# EasyEDA Pro project DCP_main.eprj, board PCB3
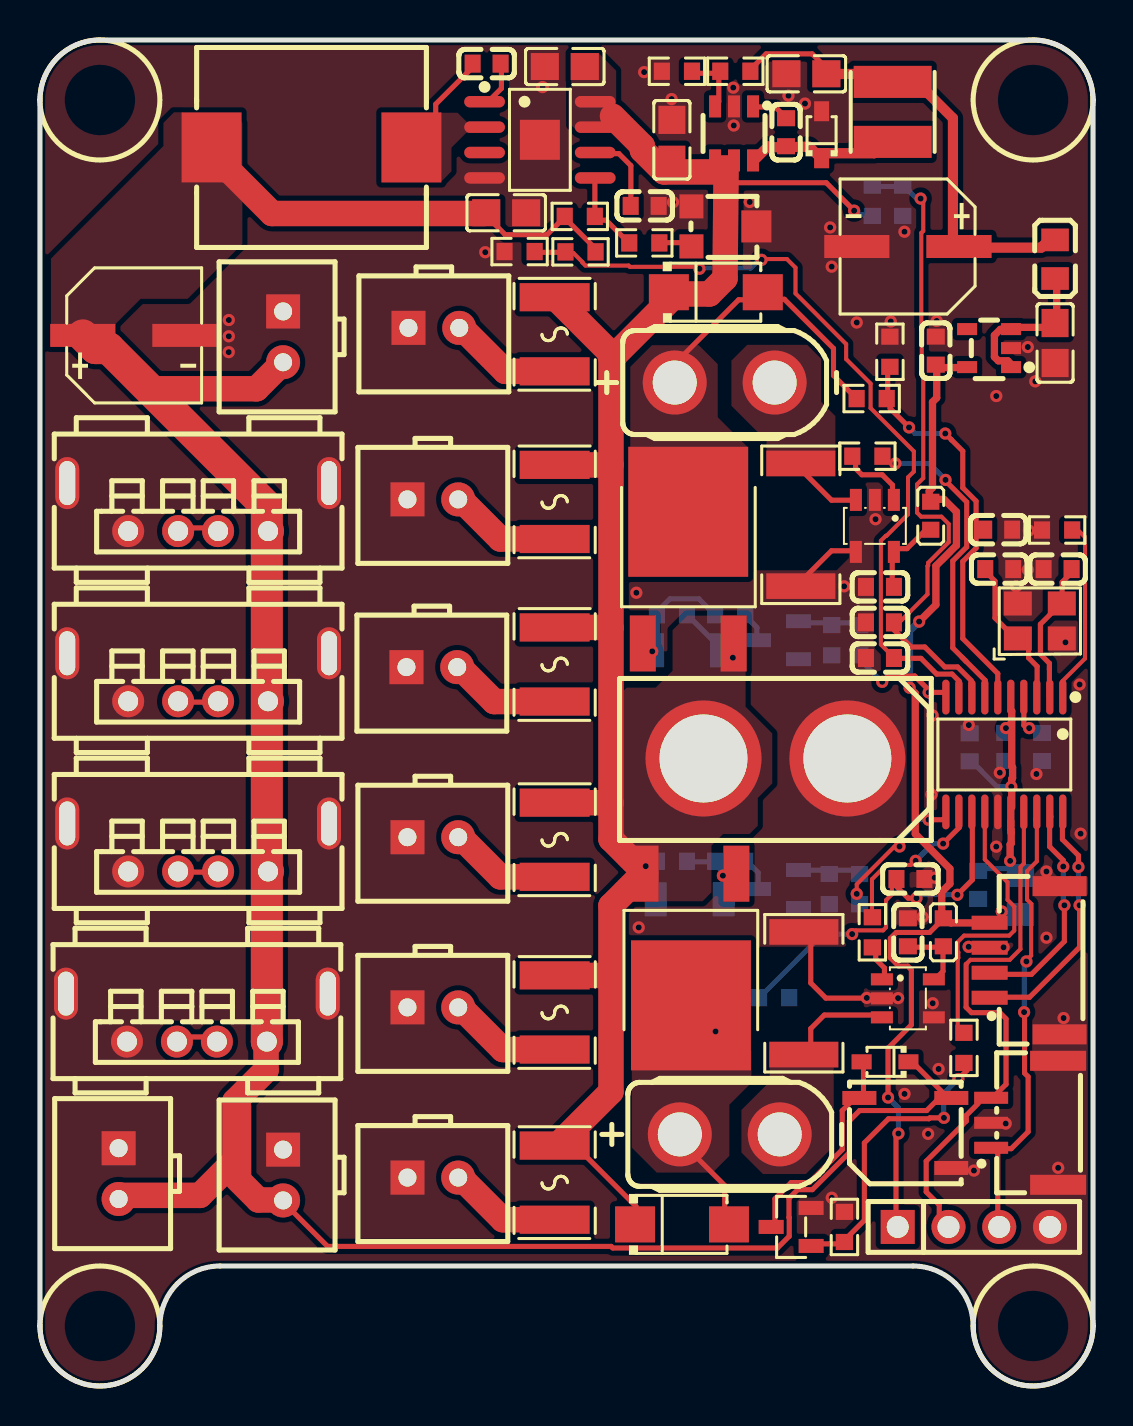
[diagram p4: board, top side]
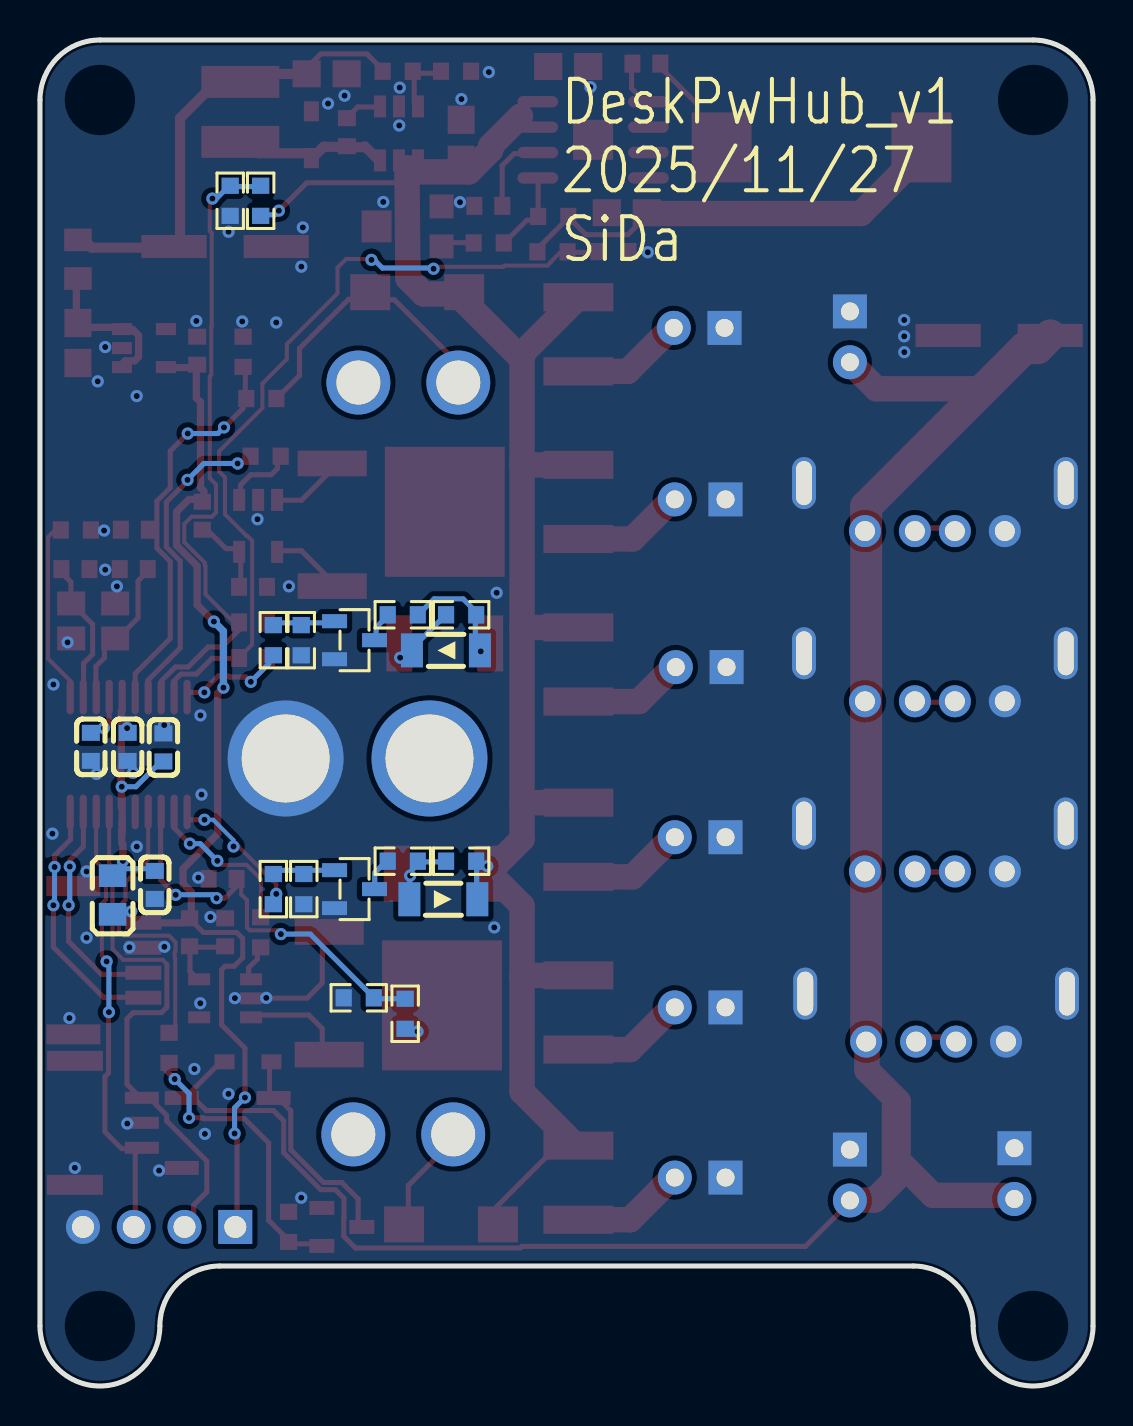
[diagram p5: board, bottom side, seen from below]

Outline 52.7 x 67.3 mm; copper layers: Top Layer, Bottom Layer. Coordinates in mm from the lower left corner of the outline.
Outline path: 0,64.3 arc(0.88,66.42) 3,67.3 49.7,67.3 arc(51.82,66.42) 52.7,64.3 52.7,3 arc(49.7,0) 46.7,3 arc(45.82,5.12) 43.7,6 9,6 arc(6.88,5.12) 6,3 arc(3,0) 0,3 0,64.3
Stack: Top Layer 0.035mm / Dielectric1 1.51mm FR4 er 4.5 / Bottom Layer 0.035mm

## Design rules (mm)
template: 自定义配置
spacing copperThickness1oz (default): track to track 0.102, other pairs 0.152 to 0.3
spacing copperThickness2oz: track to track 0.203, other pairs 0.152 to 0.3
track width copperThickness1oz (default): min 0.127, default 0.254, max 2.54
track width copperThickness2oz: min 0.203, default 0.254, max 2.54
differential pair differentialPair (default): width min 0.127, default 0.254, max 2.54; gap min 0.152, default 0.152
via viaSize (default): diameter min 0.5, default 0.61, max 10; hole min 0.3, default 0.305, max 6.3

## Placement (name value [footprint] x y rotation side)
BLE1  -  [HDR-TH_4P-P2.54-V-F]  46.74 7.95 0 top
BUZZER5  4kHz  [BUZ-SMD_L5.0-W5.5-P4.60]  43.31 12.65 180 top
C3  100nF  [C0603]  22.35 66.12 0 top
C4  10uF  [C0805]  26.26 65.97 0 top
C5  1uF  [C0603]  30.26 59.01 180 top
C6  10uF  [C0805]  23.33 58.66 180 top
C7  100uF  [CAP-SMD_BD6.3-L6.6-W6.6-RD]  4.7 52.53 180 top
C8  10uF  [C0805]  38.35 65.61 0 top
C9  100uF  [CAP-SMD_BD6.3-L6.6-W6.6-RD]  43.43 56.97 0 top
C10  10uF  [C0805]  31.62 62.31 270 top
C11  100nF  [C0603]  37.34 62.69 270 top
C12  10uF  [C0805]  50.8 52.15 90 top
C13  2.2uF  [C0603]  44.83 51.77 270 top
C14  100nF  [C0603]  50.15 31.96 90 bottom
C15  20pF  [C0603]  48.01 40.85 180 top
C16  20pF  [C0603]  50.93 40.85 0 top
C17  100nF  [C0603]  48.31 31.96 270 bottom
C19  4.7uF  [C0603]  46.96 25.06 270 bottom
C20  100nF  [C0603]  46.52 31.93 270 bottom
C21  10uF  [C0603]  42.04 39.96 0 top
C22  10uF  [C0603]  43.43 22.69 270 top
C23  1nF  [C0603]  47.95 42.82 180 top
C24  1nF  [C0603]  43.56 25.35 180 top
C25  1nF  [C0603]  42.04 36.4 0 top
C26  1nF  [C0603]  42.04 38.18 0 top
CN1  XT30UPB-F30.G.Y  [CONN-TH_XT30UPB-F]  34.27 50.17 0 top
CN4  WAFER-GH1.25-3PLB  [CONN-SMD_3P-P1.25_XUNPU_WAFER-GH1.25-3PLB]  49.28 13.16 90 top
CN5  SWD  [CONN-SMD_4P-P1.27_GH125-S04DCA-00]  49.28 21.29 90 top
CN6  XT30UPB-F30.G.Y  [CONN-TH_XT30UPB-F]  34.52 12.58 0 top
CN7  XT60-M.  [CONN-TH_XT60]  36.81 31.38 180 top
D1  P4SMA18A  [SMA_L4.3-W2.7-LS5.0-RD]  33.82 54.69 0 top
D2  ZMM18  [LL-34_L3.5-W1.5-RD]  32.38 36.78 180 bottom
D3  P4SMA18A  [SMA_L4.3-W2.7-LS5.0-RD]  32.13 8.08 0 top
D4  ZMM18  [LL-34_L3.5-W1.5-RD]  32.51 24.34 0 bottom
D9  1N5819WS  [SOD-323_L1.8-W1.3-LS2.5-RD]  39.12 62.56 90 top
D10  1N4148WS  [SOD-323_L1.8-W1.3-LS2.5-RD]  42.29 16.21 180 top
F1  SMD1812-110-33  [F1812]  25.76 10.17 90 top
F2  SMD1812-110-33  [F1812]  25.76 27.31 90 top
F3  SMD1812-110-33  [F1812]  25.76 18.68 90 top
F4  SMD1812-110-33  [F1812]  25.76 36.08 90 top
F5  SMD1812-110-33  [F1812]  25.76 44.2 90 top
F6  SMD1812-110-33  [F1812]  25.76 52.59 90 top
H5  XY-XHB2.54-2A11  [CONN-TH_2P-P2.50_XY-XHB2.54-2A11]  12.17 10.55 270 top
H8  XY-XHB2.54-2A11  [CONN-TH_2P-P2.50_XY-XHB2.54-2A11]  19.66 10.42 0 top
H9  XY-XHB2.54-2A11  [CONN-TH_2P-P2.50_XY-XHB2.54-2A11]  19.66 27.44 0 top
H10  XY-XHB2.54-2A11  [CONN-TH_2P-P2.50_XY-XHB2.54-2A11]  19.66 18.93 0 top
H11  XY-XHB2.54-2A11  [CONN-TH_2P-P2.50_XY-XHB2.54-2A11]  19.61 35.94 0 top
H12  XY-XHB2.54-2A11  [CONN-TH_2P-P2.50_XY-XHB2.54-2A11]  19.66 44.33 0 top
H13  XY-XHB2.54-2A11  [CONN-TH_2P-P2.50_XY-XHB2.54-2A11]  19.71 52.91 0 top
H15  XY-XHB2.54-2A11  [CONN-TH_2P-P2.50_XY-XHB2.54-2A11]  3.94 10.62 270 top
H16  XY-XHB2.54-2A11  [CONN-TH_2P-P2.50_XY-XHB2.54-2A11]  12.17 52.46 270 top
L1  6.8uH  [IND-SMD_L11.5-W10.0_FXL1040]  13.59 61.93 0 top
L3  1.5K  [L0805]  50.8 56.34 270 top
L4  2.5K  [L0603]  44.58 43.51 270 top
L5  2.5K  [L0603]  45.21 22.69 270 top
L6  1.5K  [L0805]  49.06 24.55 90 bottom
L7  47uH  [IND-SMD_L4.0-W4.0_FNR40XXS]  42.67 63.71 90 top
Q1  NCE40P70K  [TO-252-2_L6.6-W6.1-P4.57-LS9.9-TL-CW]  32.44 40.42 90 top
Q2  MMS8050-H-TP  [SOT-23-3_L2.9-W1.3-P1.90-LS2.4-BR]  36.96 37.29 0 bottom
Q3  NCE40P70K  [TO-252-2_L6.6-W6.1-P4.57-LS9.9-TL-CW]  32.58 22.32 270 top
Q4  MMS8050-H-TP  [SOT-23-3_L2.9-W1.3-P1.90-LS2.4-BR]  36.96 24.84 0 bottom
Q10  SS8050  [SOT-23-3_L2.9-W1.3-P1.90-LS2.4-BR]  37.59 7.95 0 top
R1  1M  [R0603]  31.62 38.56 0 bottom
R2  10K  [R0603]  34.54 38.56 0 bottom
R3  10K  [R0603]  41.02 37.29 90 bottom
R4  100K  [R0603]  39.62 37.29 90 bottom
R5  1M  [R0603]  31.62 26.24 180 bottom
R6  10K  [R0603]  34.54 26.24 0 bottom
R7  10K  [R0603]  41.02 24.84 90 bottom
R8  100K  [R0603]  39.5 24.84 90 bottom
R17  100K  [R0603]  27.01 58.48 0 top
R18  13K  [R0603]  30.24 57.16 0 top
R19  1kΩ  [RES-ADJ-SMD_JER33X-1-14]  34.23 57.98 270 top
R21  110K  [R0603]  34.8 65.74 180 top
R22  15K  [R0603]  31.88 65.74 180 top
R23  10K  [R0603]  50.9 42.8 180 top
R26  10K  [R0603]  46.24 16.91 270 top
R27  100K  [R0603]  40.26 7.95 270 top
R28  6mΩ  [R2512]  38.08 43.06 90 top
R29  10  [R0603]  41.41 46.49 0 top
R30  6mΩ  [R2512]  38.23 19.64 270 top
R31  10  [R0603]  41.66 22.69 90 top
R32  11K  [R0603]  41.62 49.37 180 top
R33  1.5K  [R0603]  42.53 51.71 270 top
R34  11K  [R0603]  34.43 18.61 270 bottom
R35  1.5K  [R0603]  36.75 19.41 180 bottom
R36  5.6K  [R0603]  27.05 56.71 0 top
R37  6.8K  [R0603]  24 56.72 0 top
R38  11K  [R0603]  41.66 59.26 270 bottom
R39  1.5K  [R0603]  43.18 59.26 90 bottom
U1  SY8205FCC  [SOIC-8_L5.0-W4.0-P1.27-LS6.0-BL-EP2.0]  25.02 62.31 270 top
U2  SY8401ABC  [SOT-23-6_L2.9-W1.6-P0.95-LS2.8-BR]  34.73 62.63 90 top
U3  TPS7A2033PDBVR  [SOT-23-5_L2.9-W1.6-P0.95-LS2.8-BR]  47.5 51.89 0 top
U4  GD32E230F4P6TR  [TSSOP-20_L6.5-W4.4-P0.65-LS6.4-BL]  48.26 31.58 180 top
U5  INA180A1IDBVR  [SOT-23-5_L3.0-W1.7-P0.95-LS2.8-BR]  41.78 43 90 top
U6  INA180A1IDBVR  [SOT-23-5_L3.0-W1.7-P0.95-LS2.8-BR]  43.43 19.38 180 top
USB2  AF 180°ZJB13.7  [USB-A-TH_AF-ZJB13.7]  7.91 26.93 180 top
USB3  AF 180°ZJB13.7  [USB-A-TH_AF-ZJB13.7]  7.85 18.42 180 top
USB4  AF 180°ZJB13.7  [USB-A-TH_AF-ZJB13.7]  7.91 35.44 180 top
USB5  AF 180°ZJB13.7  [USB-A-TH_AF-ZJB13.7]  7.91 43.95 180 top
X1  8MHz  [OSC-SMD_4P-L3.2-W2.5-BL]  50.04 38.25 0 top

## Footprints (pads in the part's own frame, mm; a bottom-side part is the same pattern mirrored in y, then rotated)
BUZ-SMD_L5.0-W5.5-P4.60
  rect 1.7x0.7 smd: 1(-2.3,-1.75) 2(2.3,-1.75) 3(-2.3,1.75)
C0603
  rect 0.8x0.9 smd: 1(-0.7,0) 2(0.7,0)
C0805
  rect 1.41x1.35 smd: 1(-1,0) 2(1,0)
CAP-SMD_BD6.3-L6.6-W6.6-RD
  rect 3.26x1.15 smd: 1(2.555,0) 2(-2.555,0)
CONN-SMD_3P-P1.25_XUNPU_WAFER-GH1.25-3PLB
  rect 0.6x1.7 smd: 1(-1.25,1.675) 2(0.001,1.675) 3(1.25,1.675)
  rect 1x2.8 smd: 4(3.1,-1.675) 5(-3.1,-1.675)
CONN-SMD_4P-P1.27_GH125-S04DCA-00
  rect 0.7x1.8 smd: 1(-1.875,1.75) 2(-0.625,1.75) 3(0.625,1.75) 4(1.875,1.75)
  rect 1x2.7 smd: 5(3.705,-1.75) 6(-3.705,-1.75)
CONN-TH_2P-P2.50_XY-XHB2.54-2A11
  rect 1.7x1.7 hole 0.9: 1(-1.27,0)
  round 1.7 hole 0.9: 2(1.27,0)
CONN-TH_XT30UPB-F
  round 3.2 hole 2.2: 1(-2.5,0) 2(2.5,0)
CONN-TH_XT60
  round 5.8 hole 4.4: 1(-3.6,0) 2(3.6,0)
F1812
  rect 1.407x3.499 smd: 1(-1.853,0) 2(1.853,0)
HDR-TH_4P-P2.54-V-F
  rect 1.7x1.7 hole 1.1: 1(-3.81,0)
  round 1.7 hole 1.1: 2(-1.27,0) 3(1.27,0) 4(3.81,0)
IND-SMD_L4.0-W4.0_FNR40XXS
  rect 1.6x3.9 smd: 1(-1.5,0) 2(1.5,0)
IND-SMD_L11.5-W10.0_FXL1040
  rect 3x3.5 smd: 1(-5,0) 2(5,0)
L0603
  rect 0.8x0.864 smd: 1(-0.7,0) 2(0.7,0)
L0805
  rect 1.133x1.377 smd: 1(-0.966,0) 2(0.966,0)
LL-34_L3.5-W1.5-RD
  rect 1.1x1.7 smd: 1(-1.7,0) 2(1.7,0)
OSC-SMD_4P-L3.2-W2.5-BL
  rect 1.4x1.2 smd: 1(-1.1,-0.875) 2(1.1,-0.875) 3(1.1,0.875) 4(-1.1,0.875)
R0603
  rect 0.806x0.864 smd: 1(-0.753,0) 2(0.753,0)
R2512
  rect 1.282x3.456 smd: 1(-3.067,0) 2(3.067,0)
RES-ADJ-SMD_JER33X-1-14
  rect 1.2x1.2 smd: 1(1,-1.625) 3(-1,-1.625)
  rect 1.6x1.5 smd: 2(0,1.625)
SMA_L4.3-W2.7-LS5.0-RD
  rect 2x1.8 smd: 1(-2.35,0) 2(2.35,0)
SOD-323_L1.8-W1.3-LS2.5-RD
  rect 1x0.75 smd: 1(-1.173,0) 2(1.173,0)
SOIC-8_L5.0-W4.0-P1.27-LS6.0-BL-EP2.0
  oval 0.574x2.038 smd: 1(-1.905,-2.769) 2(-0.635,-2.769) 3(0.635,-2.769) 4(1.905,-2.769) 5(1.905,2.769) 6(0.635,2.769) 7(-0.635,2.769) 8(-1.905,2.769)
  rect 2x2 smd: 9(0,0)
SOT-23-3_L2.9-W1.3-P1.90-LS2.4-BR
  rect 1.25x0.7 smd: 1(1,-0.95) 2(1,0.95) 3(-1,0)
SOT-23-5_L2.9-W1.6-P0.95-LS2.8-BR
  rect 1x0.6 smd: 1(1.1,-0.95) 2(1.1,0) 3(1.1,0.95) 4(-1.1,0.95) 5(-1.1,-0.95)
SOT-23-5_L3.0-W1.7-P0.95-LS2.8-BR
  rect 1.1x0.6 smd: 1(1.3,-0.95) 2(1.3,0) 3(1.3,0.95) 4(-1.3,0.95) 5(-1.3,-0.95)
SOT-23-6_L2.9-W1.6-P0.95-LS2.8-BR
  rect 1.1x0.6 smd: 1(1.35,-0.95) 2(1.35,0) 3(1.35,0.95) 4(-1.35,0.95) 5(-1.35,0) 6(-1.35,-0.95)
TO-252-2_L6.6-W6.1-P4.57-LS9.9-TL-CW
  rect 2.8x1.3 smd: 1(-3.292,2.273) 3(-3.292,-2.273)
  rect 6.5x6 smd: 2(3.292,0)
TSSOP-20_L6.5-W4.4-P0.65-LS6.4-BL
  oval 0.364x1.742 smd: 1(-2.925,-2.871) 2(-2.275,-2.871) 3(-1.625,-2.871) 4(-0.975,-2.871) 5(-0.325,-2.871) 6(0.325,-2.871) 7(0.975,-2.871) 8(1.625,-2.871) 9(2.275,-2.871) 10(2.925,-2.871) 11(2.925,2.871) 12(2.275,2.871) 13(1.625,2.871) 14(0.975,2.871) 15(0.325,2.871) 16(-0.325,2.871) 17(-0.975,2.871) 18(-1.625,2.871) 19(-2.275,2.871) 20(-2.925,2.871)
USB-A-TH_AF-ZJB13.7
  round 1.6 hole 1: 1(-3.5,1.2) 2(-1,1.2) 3(1,1.2) 4(3.5,1.2)
  oval 1.2x2.6 hole 0.8x2.2: 5(-6.55,-1.2) 5(6.55,-1.2)

## Nets
As in the schematic.

Pads without a net: U1 3; U3 4

## Via types
v1: diameter 0.61, hole 0.305, Top Layer to Bottom Layer, 95 vias

## Routing (per net, layer and track width the routed paths; a pad name or vN(x,y) marks a point on that pad's centre or on a via; arc(x,y) is an arc through that point)
12V_CTL1: length 6.4
  Top Layer w0.203: v1(40.88,24.61) 40.88,25.09 42.76,26.98 v1(43.02,26.98)
  Top Layer w0.254: 45.24,28.36 45.19,28.31 v1(44.47,28.31)
  Bottom Layer w0.203: v1(43.02,26.98) 43.02,27.29 44.03,28.31 v1(44.47,28.31)
12V_CTL2: length 5.3
  Top Layer w0.254: 44.49,34.78 43.78,35.5 43.28,35.5 43.23,35.45 42.39,35.45 v1(42.15,35.21) ; 45.34,34.55 45.21,34.68 v1(44.47,34.68)
  Bottom Layer w0.254: v1(42.15,35.21) 41.25,36.11 41.25,36.47
+3.3V: length 52.8
  Top Layer w0.254: 45.08,23.23 44.52,22.68 42.85,22.68 42.56,22.38 ; 42.55,22.38 42.55,21.42 42.98,20.99 43.43,20.99 43.61,20.81 43.61,18.06 42.44,16.89 v1(42.44,14.42) ; v1(42.96,12.62) 42.84,12.5 42.84,8.05
  Top Layer w0.363: 46.34,50.92 45.13,50.92 ; 44.75,44.33 45.24,44.33 45.86,43.71 45.86,42.03 44.83,41 44.83,39.06 v1(44,38.22) ; 44.5,44.22 44.5,44.75 44.67,44.91 44.67,49.2 44.88,49.41 44.88,50.97 ; v1(43.52,34.92) 43.8,34.63 43.8,27.61 45.54,25.86 45.54,25.11 45.13,24.7 45.13,23.48 ; 45.33,23.42 45.6,23.16 47.64,23.16
  Bottom Layer w0.254: v1(42.44,14.42) 42.96,13.9 v1(42.96,12.62)
  Bottom Layer w0.363: v1(43.52,34.92) 43.52,37.74 v1(44,38.22)
  vias: v1(48.13,23.73)
+3.3V_MCU: length 11.3
  Top Layer w0.254: 48.33,32.95 48.59,33.21
  Top Layer w0.363: v1(48.55,26.26) 48.55,27.08 48.61,27.13 48.61,27.66 48.6,27.67 48.6,27.82 48.59,27.83 48.59,28.23 ; 48.63,28.94 48.63,30.36 48.67,30.4 48.67,30.93 48.63,30.97 48.63,33.74 48.59,33.77
  Bottom Layer w0.254: 46.59,31.27 47.9,29.96 v1(48.61,29.96) ; 48.54,25.89 48.52,25.87 47.09,25.87
  vias: v1(48.34,32.89)
+5V_1: length 128
  Top Layer w0.254: 43.71,16.15 45.35,14.5 ; 12.23,9.14 14.39,6.98 28.59,6.98 28.67,6.9 36.91,6.9 37.5,7.49 37.5,8.42 37.48,8.43 37.48,9.38 37.92,9.82 38.65,9.82 40.5,11.67 40.5,13.26 41.02,13.77 44.37,13.77 45.02,14.41 45.15,14.41 45.16,14.4 ; 45.35,14.32 45.41,14.32 ; 22.69,58.16 23.28,57.57 25.38,57.57 26.18,58.37 ; 27.85,56.82 26.38,58.29 26.38,58.33
  Top Layer w1.27: 9.94,13.97 9.94,10.37 9.92,10.35 ; 12.15,9.3 10.93,9.3 9.9,10.33 ; 3.96,9.53 8.01,9.53 9.75,11.28 9.75,14.24 11.31,15.79 11.31,16.95 ; 8.59,61.65 11.61,58.62 22.24,58.62 ; H16.2 10.84,49.86 5.84,49.86
  Top Layer w1.6: USB3.1 11.35,43.97 3.43,51.89 2.78,51.89 C7.1
+5V_1_ADC: length 40.7
  Top Layer w0.203: 26.3,56.65 26.7,56.65 27.15,56.2 27.15,56.17 27.3,56.02 29.46,56.02 29.52,55.96 32.81,55.96 32.87,55.9 ; 36.27,56.35 37.38,56.35 37.81,55.92 37.81,54.63 40.34,52.09 40.34,51.34 41.57,50.12 41.57,48.9 43.73,46.73 43.73,45.73 43.44,45.43 43.44,43.59 42.36,42.51 42.33,42.51 42.08,42.26 42.08,37.07 42.77,36.39
  Top Layer w0.254: 24.75,56.68 26.09,56.68 ; 42.66,36.38 44.09,36.38 44.87,35.6 45.65,35.6 46,35.24 46,34.47
  Bottom Layer w0.254: 33,55.9 35.56,55.9 36.02,56.36
  vias: v1(33,55.86) v1(36.11,56.31)
+5V_2: length 20.4
  Top Layer w0.254: 39.48,65.77 38.65,66.61 36.34,66.61 35.51,65.78
  Top Layer w0.508: 39.75,65.6 41.81,65.6 42.23,65.19 ; 50.57,57.38 50.1,56.92 46.33,56.92 ; 45.69,57.03 45.69,63.39 44.06,65.01
+12V: length 94.9
  Top Layer w0.254: 29.83,8.02 29.83,8.98 26.87,11.94 ; 34.61,60.16 39.35,60.16 v1(40.74,58.77)
  Top Layer w0.508: 34.7,61.3 34.68,61.28 33.78,61.28
  Top Layer w1.27: F3.2 28.52,20.53 28.57,20.48 ; 28.57,51.52 28.57,46.06 ; 28.57,51.52 28.57,51.62 25.76,54.44 ; 28.57,51.52 28.53,51.48 ; 28.57,51.52 28.76,51.52 31.84,54.6 33.51,54.6 34.28,55.38 34.34,60.75 ; 28.57,46.06 F5.2 ; 28.57,46.06 28.57,37.92 ; 34.27,60.7 31.24,60.7 30.15,61.79 30.15,62 28.65,63.49 ; F2.2 28.56,29.17 28.57,29.15 ; 28.57,37.92 28.57,29.15 ; 28.57,37.92 28.56,37.93 F4.2 ; 28.57,29.15 28.57,27.35 Q3.3 30.18,25.62 28.57,24.01 28.57,20.48 ; 28.57,20.48 28.57,14.71 26.01,12.15 26.01,12.02
  Bottom Layer w0.254: 41.66,58.56 40.95,58.56 v1(40.74,58.77) ; 33.93,36.87 33.93,37.03 32.34,38.61 ; 30.85,24.51 30.85,26.16
  vias: v1(30.31,25.99) v1(34.68,36.41)
+12V_ADC: length 32.2
  Top Layer w0.203: 42.79,38.21 43.03,38.21 44.42,39.59 44.42,41 44.45,41.03 44.45,41.16 45.48,42.19 45.48,43.1 45.11,43.47 44.09,43.47 43.89,43.67 43.89,45.08 44.2,45.39 44.2,50.49 44.13,50.56 44.13,52.97 44.11,53 44.11,57.66 44.2,57.75 44.2,59.24 v1(44.07,59.37)
  Top Layer w0.254: 46.6,34.83 46.6,35.27 45.92,35.95 45.28,35.95 44.28,36.95 43.6,36.95 42.77,37.77 42.77,38.13
  Bottom Layer w0.254: 43.23,59.97 41.55,59.97 41.51,59.93 ; v1(44.07,59.37) 43.87,59.37 43.43,59.8
+12V_OUT1: length 12.4
  Top Layer w0.254: 31.78,51.13 34.97,54.31 35.97,54.31 ; 36.55,54.34 37.25,54.34 39.71,51.88 39.71,50.52 40.66,49.58
+12V_OUT1_ADC: length 19.8
  Top Layer w0.254: 47.94,34.52 47.93,34.53 47.93,35.62 46.18,37.37 46.18,41.23 46.85,41.89 46.85,44.24 46.18,44.91 46.18,46.74 45.62,47.31 45.62,47.31 v1(45.3,47.62) ; 42.48,50.83 42.46,50.85 ; 42.42,49.34 42.42,50.83 ; v1(43.49,47.93) 42.55,48.88 42.55,49.16
  Bottom Layer w0.254: v1(43.49,47.93) 43.8,47.62 v1(45.3,47.62)
+12V_OUT2: length 4.6
  Top Layer w0.254: 32.53,11.77 34.27,10.03 34.27,7.94
  vias: v1(33.81,17.73)
+12V_OUT2_ADC: length 19
  Top Layer w0.203: 42.63,25.25 42.63,24.58 42.34,24.29 42.34,22.93 42.19,22.78 40.83,22.78 v1(40.64,22.6)
  Top Layer w0.254: 42.63,25.21 42.63,25.21 43.45,24.39 v1(43.86,24.39) ; v1(45.91,24.56) 46.66,25.31 46.66,28.23
  Bottom Layer w0.254: 45.89,24.56 44.03,24.56 v1(43.86,24.39) ; v1(40.64,22.6) 39.17,22.6 36.07,19.49 ; 34.53,19.36 35.74,19.36
GND: length 10.5
  Top Layer w0.254: 38.1,40.25 39.61,41.76 40.84,41.76 ; v1(42.94,19.39) 39.33,19.39 38.57,20.15 38.57,22.61
  vias: v1(9.45,51.69) v1(9.45,53.3) v1(9.45,52.49) v1(22.28,56.69) v1(25.15,64.95) v1(29.84,39.66) v1(29.97,22.93) v1(30.24,65.69) v1(31.61,64.35) v1(31.68,59.19) v1(34.7,64.92) v1(34.72,63.03) v1(35.52,59.2) v1(37.46,64.52) v1(38.28,64.12) v1(39.54,57.93) v1(39.62,55.97) v1(39.63,9.41) v1(40.24,39.98) v1(40.88,53.17) v1(41.38,19.41) v1(41.81,43.34) v1(42.58,53.23) v1(43.26,57.71) v1(43.27,14.6) v1(44.17,23.45) v1(44.45,12.61) v1(44.62,29.57) v1(44.67,33.53) v1(44.68,19.14) v1(44.78,25.42) v1(44.87,53.25) v1(44.97,15.85) v1(46.48,33.05) v1(46.48,21.96) v1(46.74,10.77) v1(47.86,49.5) v1(47.86,26.97) v1(48.03,30.67) v1(48.22,21.93) v1(48.33,13.12) v1(48.85,39.98) v1(49.44,51.95) v1(49.43,40.81) v1(49.49,42.77) v1(49.81,50.23) v1(49.87,30.6) v1(50.37,25.73) v1(50.37,22.42) v1(50.96,10.91) v1(51.23,18.4) v1(51.32,37.18) v1(52.03,35.08) v1(52.08,27.62)
BUZZER_PWM: length 13.9
  Top Layer w0.203: 45.93,17.59 45.93,21.38 45.96,21.4 45.96,21.69 45.92,21.73 45.92,22.19 46.24,22.52 48.5,22.52 48.76,22.77 48.76,23.97 48.42,24.31 48.42,25.19 47.28,26.33 47.28,28.28 47.31,28.31
CN1_ISENSE_ADC: length 15.5
  Top Layer w0.254: v1(42.81,46.13) 42.81,45.91 ; 46.34,36.24 46.14,36.44 ; 46.34,36.24 45.68,36.9 45.68,41.25 46.38,41.95 46.38,44.2 45.32,45.26 v1(45.32,45.31) ; 46.34,36.24 47.3,35.28 47.3,34.5
  Bottom Layer w0.254: v1(45.32,45.31) 44.5,46.13 v1(42.81,46.13)
CN2_ISENSE_ADC: length 7.4
  Top Layer w0.203: 43.79,26.26 43.59,26.06 42.36,26.06 41.64,25.34 41.64,23.56
  Top Layer w0.254: v1(45.2,27.12) 46,27.92 46,28.12
  Bottom Layer w0.254: v1(43.82,26.26) 44.68,27.12 v1(45.2,27.12)
RX0: length 21.6
  Top Layer w0.203: 49.82,28.37 49.82,28.28 49.89,28.21 49.89,26.23 49.4,25.74 49.4,24.32 49.6,24.11 49.6,21.52 49.38,21.3 49.34,21.3
  Top Layer w0.254: 47.93,8.15 47.93,11.66 47.83,11.76 ; v1(49.25,18.69) 49.27,18.67 49.27,15.64 49.45,15.47 49.45,12.71 48.61,11.87 48.05,11.87
  Bottom Layer w0.254: v1(49.25,18.69) 49.25,21.11 v1(49.37,21.23)
SWCLK: length 12
  Top Layer w0.254: 51.17,28.27 51.17,27.33 51.97,26.53 v1(51.97,25.95) ; 47.71,19.44 49.52,19.44 52.03,21.94 v1(52.03,24.04)
  Bottom Layer w0.254: v1(52.03,24.04) 51.97,24.09 v1(51.97,25.95)
SWDIO: length 10.8
  Top Layer w0.254: v1(51.27,24.04) 51.27,22.23 49.62,20.58 47.67,20.58 ; 50.59,28.46 50.53,28.39 50.53,26.97 51.21,26.29 v1(51.21,25.97)
  Bottom Layer w0.254: v1(51.27,24.04) 51.21,24.09 v1(51.21,25.97)
TX0: length 25.5
  Top Layer w0.203: 49.24,28.17 49.24,28.17 49.24,26.12 49.07,25.95 49.07,21.84 48.53,21.31 46.56,21.31 46.37,21.12 46.37,21.11 46.35,21.08
  Top Layer w0.254: 47.76,14.5 48.35,15.09 48.35,18.35 ; 48.35,18.36 48.04,18.67 46.62,18.67 46.35,18.94 46.35,21.08 ; 45.26,7.98 45,8.24 45,9.05 44.35,9.71 44.35,11.24 46.36,13.25 46.36,13.53 46.96,14.13
$1N445: length 2
  Top Layer w0.254: 6.89,25.69 8.8,25.69 8.86,25.75
$1N449: length 2.6
  Top Layer w0.254: 6.86,17.45 8.89,17.45 9.3,17.05
$1N454: length 1.9
  Top Layer w0.254: 8.91,34.19 7.03,34.19 7,34.22
$1N653: length 2.7
  Top Layer w0.254: 9.06,42.9 6.6,42.9 6.41,42.71
$1N1761: length 5.2
  Bottom Layer w0.254: 30.93,38.63 30.93,38.76 31.52,39.36 32.98,39.36 33.64,38.69 ; 30.91,38.55 30.91,37.27 30.53,36.89
  vias: v1(30.64,36.73)
$1N2098: length 2.9
  Bottom Layer w0.254: 38.13,38.31 38.28,38.16 40.98,38.16
$1N2111: length 1.5
  Bottom Layer w0.254: 35.88,37.27 35.88,37.92 35.25,38.55
$1N2457: length 3
  Bottom Layer w0.254: 38.04,25.79 40.99,25.79 41.06,25.72
$1N2465: length 2.2
  Bottom Layer w0.254: 34.12,25.64 34.12,25.75 33.97,25.9 ; 34.2,24.71 34.2,25.42 ; 32.53,26.2 33.73,26.2
  vias: v1(34.18,25.52)
$1N2467: length 1.4
  Bottom Layer w0.254: 35.94,24.98 35.94,25.67 35.41,26.2
$1N6697: length 3.6
  Top Layer w0.254: 21.68,65.97 19.8,64.09 19.8,63.14
$1N6701: length 2
  Top Layer w0.254: 22.4,64.19 23.09,64.88 23.09,65.93
$1N6872: length 3.6
  Top Layer w0.254: 28.04,61.64 28.06,61.62 28.97,61.62 29.57,61.02 29.57,59.16
$1N7190: length 3.9
  Top Layer w0.254: 27.91,60.36 27.77,60.23 27.77,58.56 ; 27.79,58.29 28.33,58.29 29.4,57.23
$1N7369: length 1.4
  Top Layer w0.254: 31.1,57.17 32.22,57.17 32.41,56.97
$1N7838: length 5.8
  Top Layer w1.27: 21.06,10.42 23.16,8.31 26.01,8.31
$1N7954: length 5.8
  Top Layer w1.27: 21.06,27.44 23.04,25.46 26.01,25.46
$1N8071: length 5.8
  Top Layer w1.27: 26.01,16.82 23.16,16.82 21.06,18.93
$1N8188: length 5.7
  Top Layer w1.27: 21.01,35.94 22.73,34.22 26.01,34.22
$1N8305: length 5.8
  Top Layer w1.27: 21.06,44.33 23.04,42.35 26.01,42.35
$1N8422: length 5.8
  Top Layer w1.27: 21.11,52.91 23.28,50.73 26.01,50.73
$1N9096: length 7.2
  Top Layer w0.508: 42.1,61.99 41.75,61.64 38.98,61.64 ; 36.45,61.99 35.67,61.21 ; 39.06,61.41 38.5,61.97 37.3,61.94 36.45,61.94
$1N9345: length 3.1
  Top Layer w0.254: 33.78,64.03 33.97,64.22 33.97,65.64 ; 34.01,65.73 33.91,65.64 32.62,65.64
$1N9475: length 1.9
  Top Layer w0.254: 37.32,63.43 36.8,63.95 35.66,63.95
$1N9720: length 7.4
  Top Layer w0.363: 50.75,52.91 50.72,52.93 48.54,52.93 ; 48.65,51.05 48.43,51.26 47.96,51.26 47.76,51.46 47.76,52.53 48.06,52.83 48.51,52.83 ; 50.88,55.14 50.88,53.11 50.96,53.03
$1N10926: length 1
  Top Layer w0.254: 49.45,32.83 49.24,33.04 49.24,33.75
  vias: v1(49.5,32.89)
$1N10928: length 6.2
  Top Layer w0.254: 49.32,37.05 49.47,36.9 49.47,36.41 49.9,35.98 49.9,34.43 ; 47.38,40.66 47.79,40.25 47.79,38.4 48.44,37.76
$1N10929: length 6.6
  Top Layer w0.254: 50.68,38.7 50.07,38.09 50.07,36.59 50.52,36.13 50.52,35.83 ; 51.63,40.67 51.15,40.19 51.15,39.18 ; 50.52,36.07 50.52,35.83 ; 50.52,35.83 50.52,34.5
$1N10931: length 9.3
  Top Layer w0.203: 51.57,42.87 51.68,42.98 51.76,42.98 52.3,42.44 52.3,36.37 51.18,35.25 51.18,34.65
$1N10985: length 14.4
  Top Layer w0.254: v1(45.24,13.41) 44.54,13.41 44.49,13.36 42.46,13.36 41.26,12.16 41.26,8.28 40.18,7.21 ; v1(45.96,15.35) 46.39,15.78 46.39,16.36 ; 39,7.11 40.08,7.11
  Bottom Layer w0.254: v1(45.24,13.41) 45.24,14.63 v1(45.96,15.35)
$1N10986: length 10.3
  Top Layer w0.254: 41.21,16.34 41.21,14.62 41.06,14.46 ; 40.66,14.28 40.15,13.77 40.15,11.82 38.5,10.17 37.6,10.17 36.78,9.36 36.78,8.04
$1N11713: length 3.2
  Top Layer w0.254: 38.22,45.68 39.61,44.29 40.84,44.29
$1N11917: length 3.7
  Top Layer w0.254: 42.65,39.99 42.65,41.46 42.8,41.61 ; 42.75,41.87 43.39,41.87 44.38,42.86
$1N11957: length 3.3
  Top Layer w0.254: 42.66,44.4 42.66,45.05 42.15,45.56 41.13,45.56 40.82,45.87 40.82,46.35
$1N12229: length 3.3
  Top Layer w0.254: 45.19,21.97 45.19,20.73 44.89,20.43 ; 45.13,21.9 45.15,21.88 ; 43.49,21.94 45.09,21.94
$1N12235: length 1.7
  Top Layer w0.254: 42.26,20.27 42.26,20.9 41.82,21.34 41.82,21.76
$1N12268: length 5
  Top Layer w0.254: 38.57,16.9 38.57,17.87 39.25,18.55 42.32,18.55

## Copper pours and planes (outline as drawn; the poured copper is in the pictures)
+5V_1 on Top Layer: 0.55,63.68 10.13,63.68 10.13,52.72 0.55,52.72
+12V on Top Layer: 26.58,66.63 28.83,66.63 28.83,62.66 26.58,62.66
+12V on Top Layer: 28.58,38.52 36.65,38.52 36.65,24.24 28.58,24.24
+12V_OUT1 on Top Layer: 29.54,52.04 35.43,52.04 35.43,46.08 29.54,46.08
+12V_OUT2 on Top Layer: 29.62,17.12 35.6,17.12 35.6,10.68 29.62,10.68
GND on Top Layer: 36.53,34.39 43.32,34.39 43.32,22.97 36.53,22.97
GND on Top Layer: -2.3,69.5 52.88,69.5 52.88,-0.48 -2.3,-0.48
GND on Top Layer: 36.37,39.39 42.2,39.39 42.2,32.34 36.37,32.34
GND on Bottom Layer: -0.95,68.18 53.37,68.18 53.37,-0.72 -0.95,-0.72
$1N6697 on Top Layer: 20,63.66 22.06,63.66 22.06,60.19 20,60.19
$1N11713 on Top Layer: 34.6,52.06 39.8,52.06 39.8,46.24 34.6,46.24
$1N12268 on Top Layer: 35.1,16.97 39.72,16.97 39.72,10.6 35.1,10.6

## Text on the board
Bottom Silkscreen Layer: DeskPwHub_v1 / 2025/11/27 / SiDa
